# EAGLE schematic MultiDrop (EAGLE 7.6.0)
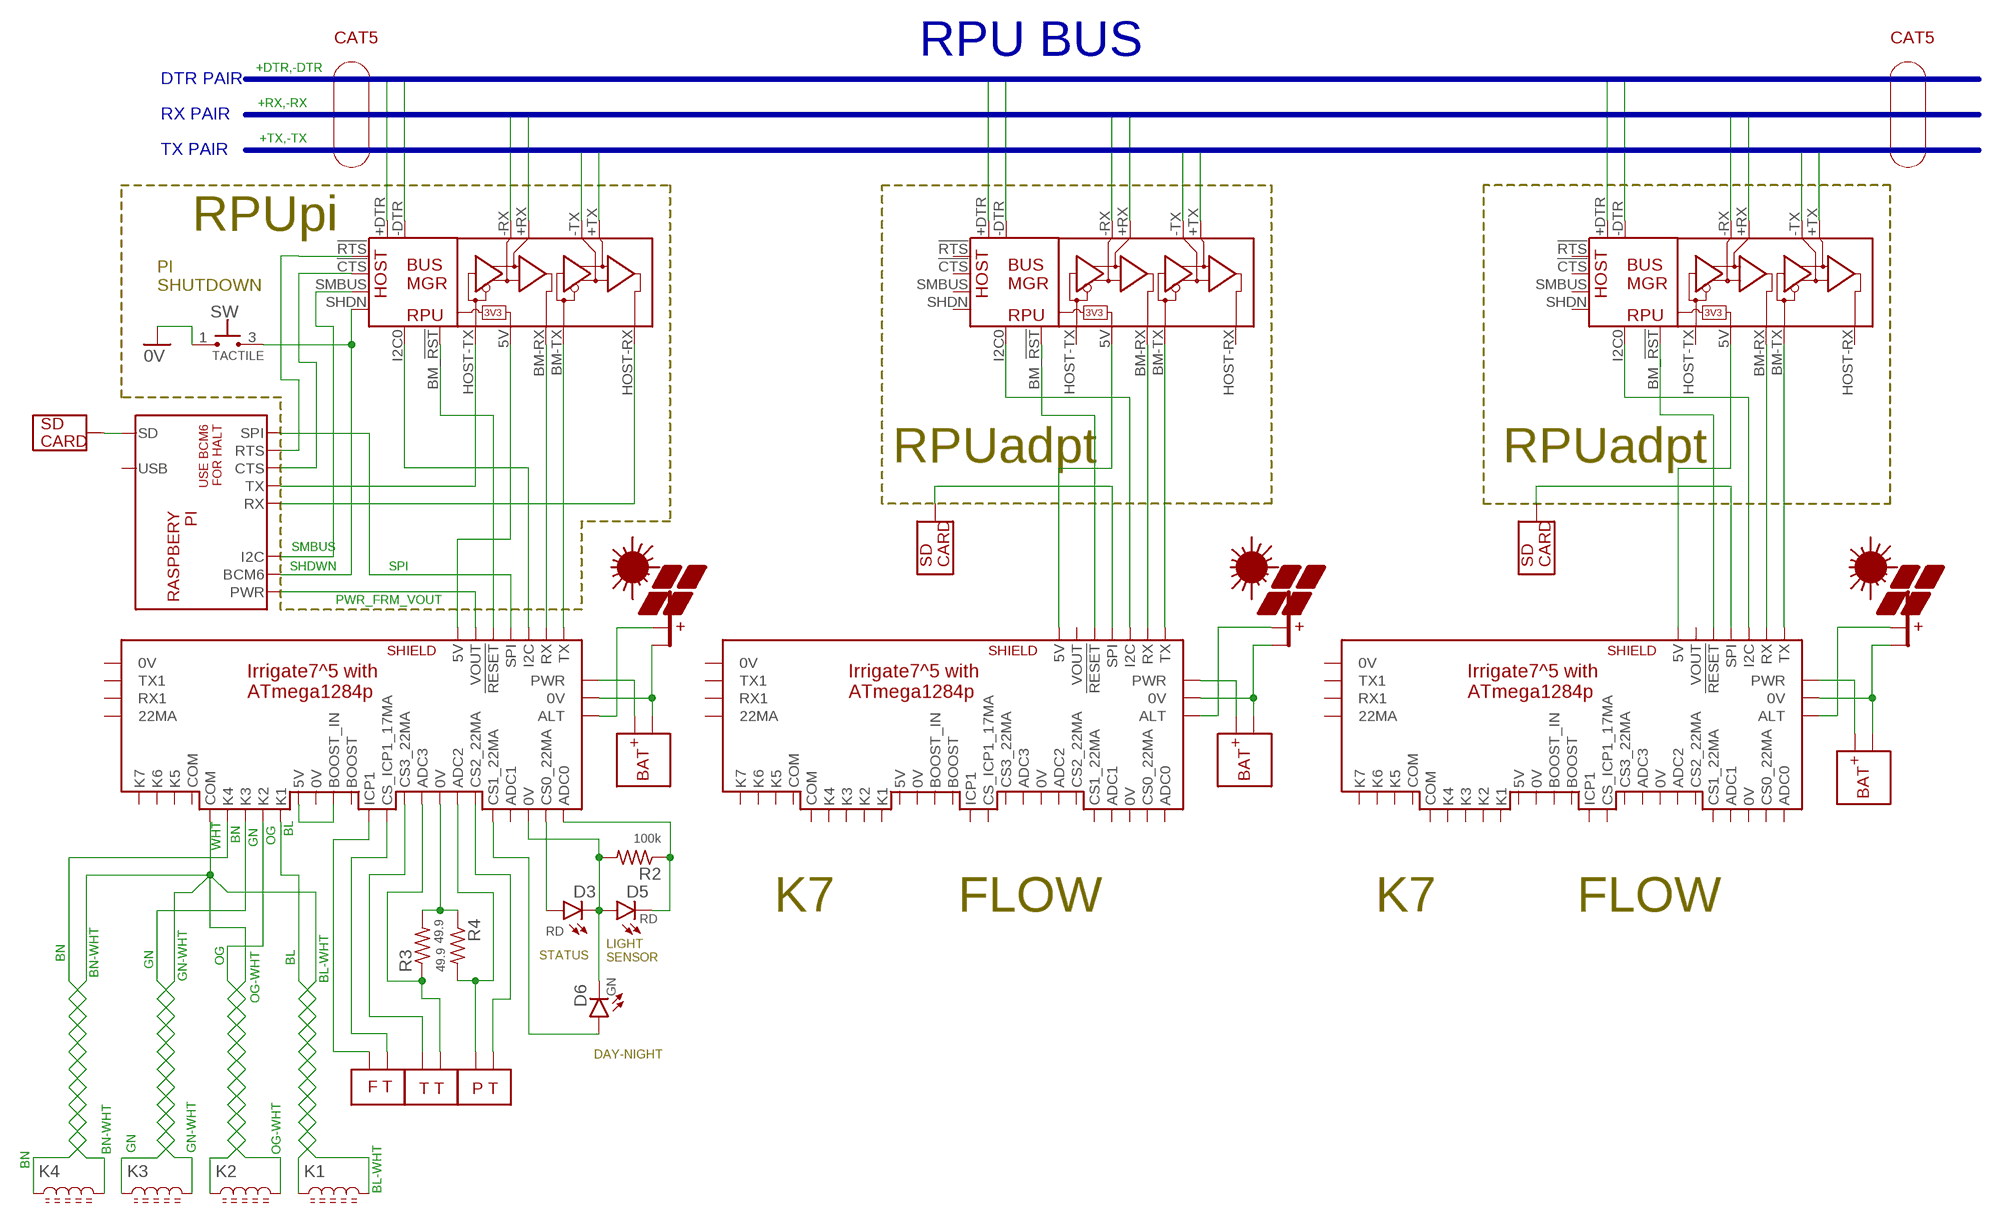
[diagram p0: schematic, sheet 1]

## Parts
D3  RD  LED5MM  [LED5MM]
D5  RD  LED5MM  [LED5MM]
D6  GN  LED5MM  [LED5MM]
K1  L0805  [C0805(2012)]
K2  L0805  [C0805(2012)]
K3  L0805  [C0805(2012)]
K4  L0805  [C0805(2012)]
PV1  PV  [NA-30]
PV2  PV  [NA-30]
PV4  PV  [NA-30]
R2  100k  R0805  [C0805(2012)]
R3  49.9  R0805  [C0805(2012)]
R4  49.9  R0805  [C0805(2012)]
SD1  SD  [NA-30]
SD2  SD  [NA-30]
SD3  SD  [NA-30]
SW  TACTILE  TAC_SW  [KS11]
U$1  BUS_MGR  [WITH_RPU_NAMES]
U$2  IRRIGATE7  [WITH_RPU_NAMES]
U$3  BAT  [NA-30]
U$4  IRRIGATE7  [WITH_RPU_NAMES]
U$5  FT  [NA-30]
U$6  TT  [NA-30]
U$7  BAT  [NA-30]
U$8  BUS_MGR  [WITH_RPU_NAMES]
U$9  BAT  [NA-30]
U$10  IRRIGATE7  [WITH_RPU_NAMES]
U$11  PT  [NA-30]
U$12  BUS_MGR  [WITH_RPU_NAMES]
U$13  PI  [NA-30]

## Nets
0V: SW.1
+DTR: U$1.+DTR
+DTR1: U$8.+DTR
+DTR3: U$12.+DTR
+RX: U$1.+RX
+RX1: U$8.+RX
+RX3: U$12.+RX
+TX: U$1.+TX
+TX1: U$8.+TX
+TX3: U$12.+TX
-DTR: U$1.-DTR
-DTR1: U$8.-DTR
-DTR3: U$12.-DTR
-RX: U$1.-RX
-RX1: U$8.-RX
-RX3: U$12.-RX
-TX: U$1.-TX
-TX1: U$8.-TX
-TX3: U$12.-TX
BL: K1.1 U$2.K1
BL-WHT: K1.2
BN: K4.1 U$2.K4
BN-WHT: K4.2
GN: K3.1 U$2.K3
GN-WHT: K3.2
N$1: U$1.BM-TX(BM_TX) U$2.TX
N$2: U$1.BM-RX(BM_RX) U$2.RX
N$3: SD1.1(PV_PWR) U$13.9(SD)
N$4: U$1.!CTS U$13.1(CTS)
N$5: U$1.!RTS U$13.2(RTS)
N$6: D3.K D5.A D6.K R2.2 U$2.0V@ADC2(0V)
N$7: D3.A U$2.22MA@ADC0(CS0_22MA)
N$8: U$1.HOST-RX(HOST_RX) U$13.3(RX)
N$9: U$1.HOST-TX(HOST_TX) U$13.4(TX)
N$10: U$4.TX U$8.BM-TX(BM_TX)
N$11: U$4.RX U$8.BM-RX(BM_RX)
N$12: PV2.2(-PV) U$4.0V@PWR(0V) U$9.2(-BAT)
N$13: PV4.2(-PV) U$7.2(-BAT) U$10.0V@PWR(0V)
N$14: U$10.TX U$12.BM-TX(BM_TX)
N$15: PV4.1(+PV) U$10.AUX(ALT)
N$16: U$7.1(+BAT) U$10.PWR
N$17: U$2.ICP1 U$5.2(PWR)
N$18: R3.2 R4.1 U$2.ICP3(0V)
N$19: U$2.17MA@ICP1(CS_ICP1_17MA) U$5.1(PL)
N$20: R4.2 U$2.ADC4(ADC2) U$11.2(PWR)
N$21: U$10.RX U$12.BM-RX(BM_RX)
N$22: PV2.1(+PV) U$4.AUX(ALT)
N$23: U$2.5V U$2.BOOST_IN
N$24: U$2.22MA@ADC5(CS3_22MA) U$6.2(PWR)
N$25: R3.1 U$2.ADC5(ADC3) U$6.1(4TO20)
N$26: D6.A U$2.22MA@ADC1(CS1_22MA)
N$27: SD3.1(PV_PWR) U$4.SPI
N$28: SD2.1(PV_PWR) U$10.SPI
N$29: U$1.5V(PWR) U$2.SHLD_5V(5V)
N$30: U$1.BM_!RST!(BM-!RST!) U$2.!RESET
N$31: U$2.22MA@ADC4(CS2_22MA) U$11.1(4TO20)
N$32: U$10.I2C U$12.I2C0
N$33: U$1.I2C0 U$2.I2C
N$36: PV1.2(-PV) U$2.0V@PWR(0V) U$3.2(-BAT)
N$37: D5.K R2.1 U$2.ADC0
N$41: U$10.SHLD_5V(5V) U$12.5V(PWR)
N$42: U$4.PWR U$9.1(+BAT)
N$43: U$10.!RESET U$12.BM_!RST!(BM-!RST!)
N$44: U$4.!RESET U$8.BM_!RST!(BM-!RST!)
N$45: U$4.SHLD_5V(5V)
N$48: U$4.I2C U$8.I2C0
N$52: U$2.PWR U$3.1(+BAT)
N$54: PV1.1(+PV) U$2.AUX(ALT)
OG: K2.1 U$2.K2
OG-WHT: K2.2
PWR_FRM_VOUT: U$2.SHLD_VOUT(VOUT) U$13.12(PWR)
SHDWN: SW.3 U$1.SHDN U$13.7(BCM6)
SMBUS: U$1.SMBUS U$13.8(I2C)
SPI: U$2.SPI U$13.10(SPI)
WHT: U$2.COM@K4(COM)
Unconnected: U$2.0V U$2.17MA@ICP3(0V) U$2.22MA@DIO2(22MA) U$2.ADC1 U$2.BOOST U$2.COM@K5(COM) U$2.DIO2(RX1) U$2.DIO3(TX1) U$2.K5 U$2.K6 U$2.K7 U$4.0V U$4.0V@ADC2(0V) U$4.5V U$4.17MA@ICP1(CS_ICP1_17MA) U$4.17MA@ICP3(0V) U$4.22MA@ADC0(CS0_22MA) U$4.22MA@ADC1(CS1_22MA) U$4.22MA@ADC4(CS2_22MA) U$4.22MA@ADC5(CS3_22MA) U$4.22MA@DIO2(22MA) U$4.ADC0 U$4.ADC1 U$4.ADC4(ADC2) U$4.ADC5(ADC3) U$4.BOOST U$4.BOOST_IN U$4.COM@K4(COM) U$4.COM@K5(COM) U$4.DIO2(RX1) U$4.DIO3(TX1) U$4.ICP1 U$4.ICP3(0V) U$4.K1 U$4.K2 U$4.K3 U$4.K4 U$4.K5 U$4.K6 U$4.K7 U$4.SHLD_VOUT(VOUT) U$8.5V(PWR) U$8.!CTS U$8.!RTS U$8.HOST-RX(HOST_RX) U$8.HOST-TX(HOST_TX) U$8.SHDN U$8.SMBUS U$10.0V U$10.0V@ADC2(0V) U$10.5V U$10.17MA@ICP1(CS_ICP1_17MA) U$10.17MA@ICP3(0V) U$10.22MA@ADC0(CS0_22MA) U$10.22MA@ADC1(CS1_22MA) U$10.22MA@ADC4(CS2_22MA) U$10.22MA@ADC5(CS3_22MA) U$10.22MA@DIO2(22MA) U$10.ADC0 U$10.ADC1 U$10.ADC4(ADC2) U$10.ADC5(ADC3) U$10.BOOST U$10.BOOST_IN U$10.COM@K4(COM) U$10.COM@K5(COM) U$10.DIO2(RX1) U$10.DIO3(TX1) U$10.ICP1 U$10.ICP3(0V) U$10.K1 U$10.K2 U$10.K3 U$10.K4 U$10.K5 U$10.K6 U$10.K7 U$10.SHLD_VOUT(VOUT) U$12.!CTS U$12.!RTS U$12.HOST-RX(HOST_RX) U$12.HOST-TX(HOST_TX) U$12.SHDN U$12.SMBUS U$13.11(USB)

## Buses
+DTR,-DTR
+RX,-RX
+TX,-TX

## Notes on the sheet
- CAT5 | CAT5
- RPU BUS
- DTR PAIR
- RX PAIR
- TX PAIR
- RPUpi
- PI
  SHUTDOWN
- RPUadpt | RPUadpt
- K7 | FLOW | K7 | FLOW
- STATUS
- LIGHT
  SENSOR
- DAY-NIGHT

## Library data of the parts
D3 D5 D6 = D-LED:LED: LED 120120WH [CREE,XHGAWT-00-0000-00000HXE1] LED WHITE 6500K 150LUM-W120120
K1-K4 = L-PWR:L: Inductor
PV1 PV2 PV4 = Documentation:PV
R2-R4 = R-C:R: Resiistor American-style symbol
SD1-SD3 = Documentation:SD
SW = S-Tactile:TAC_SW: KS11 [C&K,KS11R21CQE] SWITCH PUSHBUTTON SPST-NO 25MA 50V PAD 0805
U$1 U$8 U$12 = Documentation:BUS_MGR: RPU BUS MANAGER
U$2 U$4 U$10 = Documentation:IRRIGATE7: BM /w 1284p
U$3 U$7 U$9 = Documentation:BAT
U$5 = Documentation:FT
U$6 = Documentation:TT
U$11 = Documentation:PT
U$13 = Documentation:PI: Raspbery Pi